# Altium project LEAF2GRID.PRJPCB
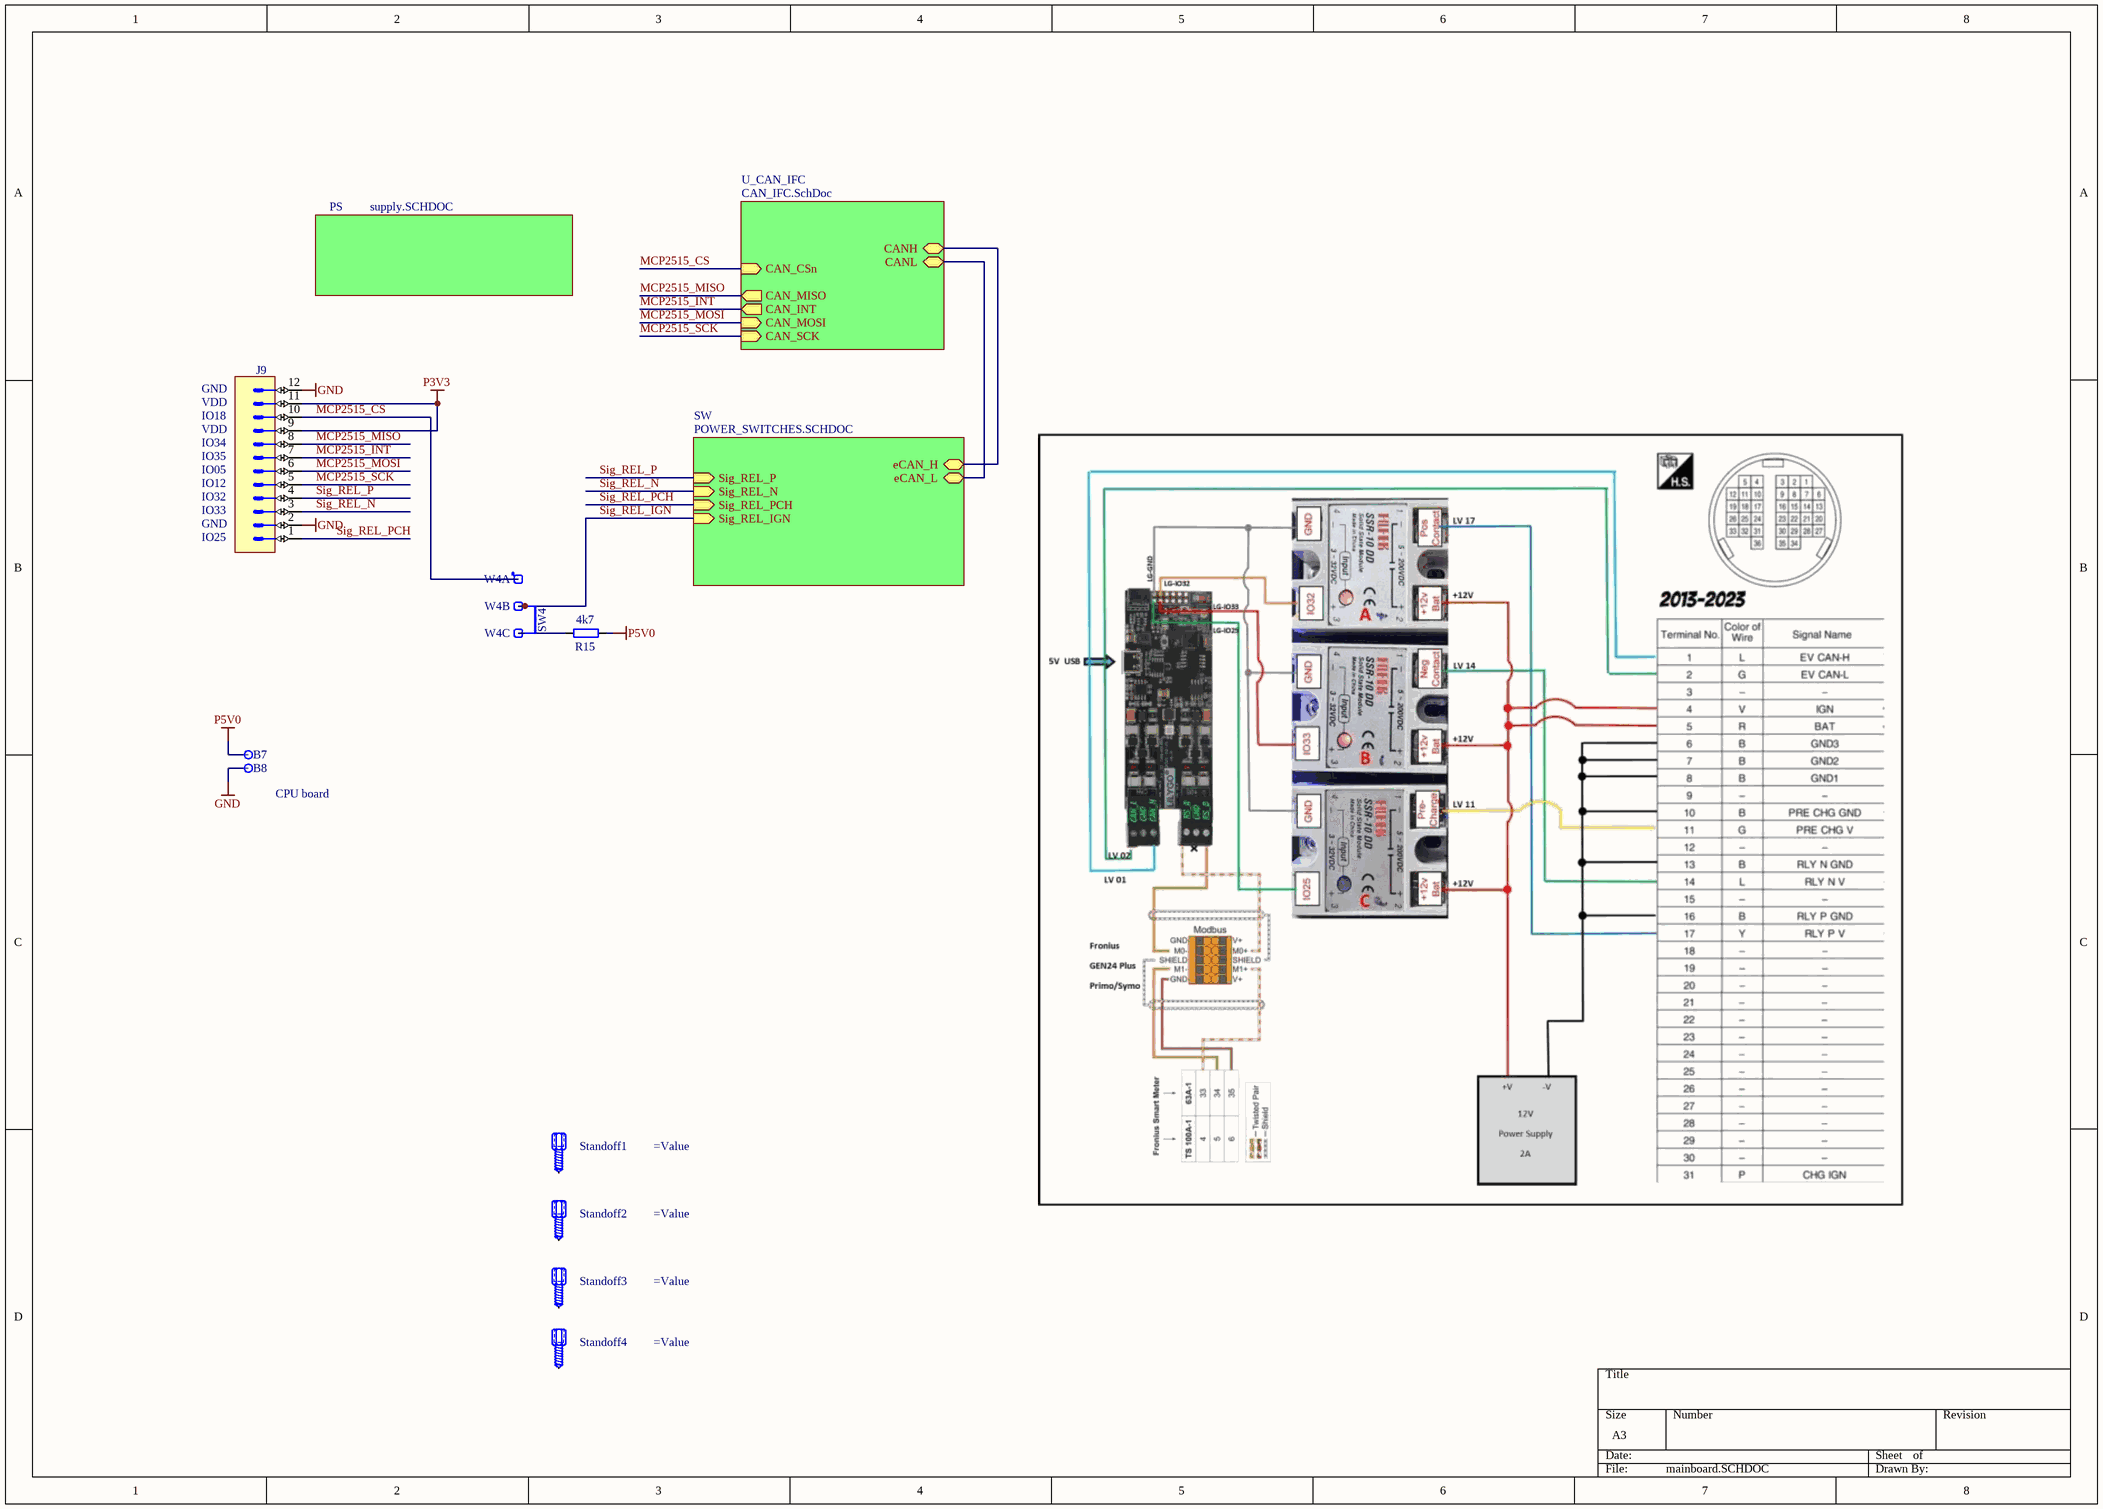
[diagram p0: mainboard.SCHDOC]
4 sheets, 117 parts. Net scope: hierarchical (ports join the sheet entries above them; power ports are global).
Board file: LEAF2GRID.PCBDOC
Sheets:
  mainboard.SCHDOC
    SW = POWER_SWITCHES.SCHDOC
    PS = supply.SCHDOC
    U_CAN_IFC = CAN_IFC.SchDoc

## Sheet mainboard.SCHDOC
size A3

### Parts
B7  Plated Hole  [c150h80]  (value not drawn)  (no BOM)
B8  Plated Hole  [c150h80]  (value not drawn)  (no BOM)
J9  Header 12  [SAMTEC_TSW-106-23-L-D]  (value not drawn)
R15  4k7  [RESC1608X55N]
Standoff1  (no value)  [ETTINGER_005.13.113]
Standoff2  (no value)  [ETTINGER_005.13.113]
Standoff3  (no value)  [ETTINGER_005.13.113]
Standoff4  (no value)  [ETTINGER_005.13.113]
SW4  Jumper Type1  [JUMPER_BLACK_INSULATED_2.54MM]  (value not drawn)
W4  Test Point  [COMATEL_385.0358.1.03.400]  (value not drawn)  (parts A,B,C of 3)

### Sub-sheets
PS = supply.SCHDOC: no entries
SW = POWER_SWITCHES.SCHDOC: Sig_REL_P (in), Sig_REL_N (in), Sig_REL_PCH (in), Sig_REL_IGN (in), eCAN_H (bidir), eCAN_L (bidir)
U_CAN_IFC = CAN_IFC.SchDoc: CANH (bidir), CANL (bidir), CAN_CSn (in), CAN_MISO (out), CAN_SCK (in), CAN_INT (out), CAN_MOSI (in)

### Nets
GND: B8.1 J9.2 J9.12
P3V3: J9.9 J9.11
P5V0: B7.1 R15.2
eCAN_H: sheet SW/eCAN_H, sheet U_CAN_IFC/CANH
eCAN_L: sheet SW/eCAN_L, sheet U_CAN_IFC/CANL
MCP2515_CS: J9.10 W4.1 ; sheet U_CAN_IFC/CAN_CSn  [project net CAN_CSn]
MCP2515_INT: J9.7 ; sheet U_CAN_IFC/CAN_INT  [project net CAN_INT]
MCP2515_MISO: J9.8 ; sheet U_CAN_IFC/CAN_MISO  [project net CAN_MISO]
MCP2515_MOSI : J9.6 ; sheet U_CAN_IFC/CAN_MOSI  [project net CAN_MOSI]
MCP2515_SCK: J9.5 ; sheet U_CAN_IFC/CAN_SCK  [project net CAN_SCK]
Sig_REL_IGN: SW4.1 W4.2 ; sheet SW/Sig_REL_IGN
Sig_REL_N: J9.3 ; sheet SW/Sig_REL_N
Sig_REL_P: J9.4 ; sheet SW/Sig_REL_P
Sig_REL_PCH: J9.1 ; sheet SW/Sig_REL_PCH
NetR15_1: R15.1 W4.3

Not connected (* = marked no-connect by the designer): Standoff1 1; Standoff2 1; Standoff3 1; Standoff4 1

### Notes on the sheet
- (near J9) IO34
- VDD
- (near J9) IO18
- GND
- (near J9) IO32
- (near J9) IO33
- (near J9) IO12
- (near J9) IO05
- (near J9) IO35
- (near J9) IO25
- CPU board

### Library data of the parts
B7 B8 = PLATED_HOLE0.8_PAD1.5: Single Terminal Socket; Part Description: Plated Through Hole: Hole Dia.=0.8mm Pad Dia.=1.5mm, IPC-7251 Level A; Mounted: No; Part Number: PLATED_HOLE0.8_PAD1.5; Component Type: Standard (No BOM); Pin Count: 1; Family: Plated Hole; Socket: No; SMD: No; Sense: No; Status: None; ComponentHeight: 0mm; HelpURL: Undefined; Author: CERN DEM JLC; CreateDate: 11.05.2017; LatestRevisionDate: 11.05.2017; PackageDescription: Plated Through Hole: Hole Dia.=0.8mm Pad Dia.=1.3mm, IPC-7251 Level A
J9 = SAMTEC_TSW-106-23-L-D: Connector 12 Male; Part Description: 12 Contacts, Pitch 2.54mm, Dual Row Through Mount Straight Header (Post Lead 5.84mm, Tail Lead 2.92mm, Insulator 2.54mm); Manufacturer: SAMTEC; PressFit: No; Part Number: SAMTEC_TSW-106-23-L-D; Component Kind: Standard; Component Type: Standard; Pin Count: 12; Family: Header 12; Mounted: Yes; Socket: No; SMD: No; Sense: No; Status: None; Manufacturer Part Number: TSW-106-23-L-D; ComponentHeight: 8.38mm; HelpURL: \\cern.ch\dfs\Applications\Altium\Datasheets\SAMTEC_TSW-106-23-L-D.pdf; Author: CERN DEM MR; CreateDate: 08.03.2017; LatestRevisionDate: 08.03.2017
R15 = R0603_4K7_1%_0.1W_100PPM: Resistor - 1%; Part Description: General Purpose Thick Film Chip Resistor; Manufacturer: GENERIC; Manufacturer1 Part Number: NRC06F4701TRF; Power: 0.1W; TC: ±100ppm/°C; PressFit: No; Part Number: R0603_4K7_1%_0.1W_100PPM; Component Kind: Standard; Component Type: Standard; Pin Count: 2; Value: 4k7; Status: Preferred; Tolerance: ±1%; Manufacturer Part Number: R0603_4K7_1%_0.1W_100PPM; Case: 0603; Mounted: Yes; Sense: No; Socket: No; SMD: Yes; Manufacturer1 Example: NIC COMPONENT; Manufacturer1 ComponentHeight: 0.55mm; HelpURL: \\cern.ch\dfs\Applications\Altium\Datasheets\R0603_NIC_NRC.pdf; Author: CERN DEM JLC; CreateDate: 03.12.2007; LatestRevisionDate: 13.03.2008
Standoff1-Standoff4 = ETTINGER_005.13.113: Standoff Male-Female; Part Description: Standoff Nickel-Plated Brass M/F AF5.5x11 F=M3x7 M=M3x6; PressFit: No; Part Number: ETTINGER_005.13.113; Component Kind: Standard; Component Type: Mechanical; Pin Count: 1; PackageDescription: Standoff Nickel-Plated Brass M/F AF5.5x11 F=M3x7 M=M3x6; Mounted: Yes; Socket: No; SMD: No; Sense: No; Status: None; Manufacturer: ETTINGER; Manufacturer Part Number: 005.13.113; ComponentHeight: 11mm; HelpURL: \\cern.ch\dfs\Applications\Altium\Datasheets\ETTINGER_005.13.113.pdf; Author: CERN DEM HF; CreateDate: 17.05.2023; LatestRevisionDate: 17.05.2023
SW4 = COMATEL_313.1730.0.00.40.0: Jumper 1 Pin; Part Description: Closed Insulated Black Jumper Pitch 2.54mm; Manufacturer: KONTEK COMATEL; PressFit: No; SCEM: 09.55.10.960.9; Part Number: COMATEL_313.1730.0.00.40.0; Component Kind: Accessories; Component Type: Standard; Pin Count: 1; Family: Jumper; Mounted: Yes; Socket: No; SMD: No; Sense: No; Status: Obsolete; Manufacturer Part Number: 313.1730.0.00.40.0; ComponentHeight: 6.5mm; HelpURL: \\cern.ch\dfs\Applications\Altium\Datasheets\COMATEL_313.1730.0.00.40.0.pdf; Author: CERN DEM JLC; CreateDate: 09.04.2008; LatestRevisionDate: 27.08.2013
W4 = COMATEL_385.0358.1.03.400: 3 Mini Wire-Wrap Contact Strip Header; Part Description: 3 Contacts Straight Strip Header Pitch 2.54mm L=6.3mm ''Mini-Wire-Wrap''; Manufacturer: KONTEK COMATEL; PressFit: No; Part Number: COMATEL_385.0358.1.03.400; Component Kind: Standard; Component Type: Standard; Pin Count: 3; Family: Test Point; Mounted: Yes; Socket: No; SMD: No; Sense: No; Status: Not recommended; Manufacturer Part Number: 385.0358.1.03.400; ComponentHeight: 8mm; HelpURL: \\cern.ch\dfs\Applications\Altium\Datasheets\COMATEL_385.0358.1.03.400.pdf; Author: CERN DEM JLC; CreateDate: 30.06.2010; LatestRevisionDate: 10.10.2012

## Sheet POWER_SWITCHES.SCHDOC
size A3
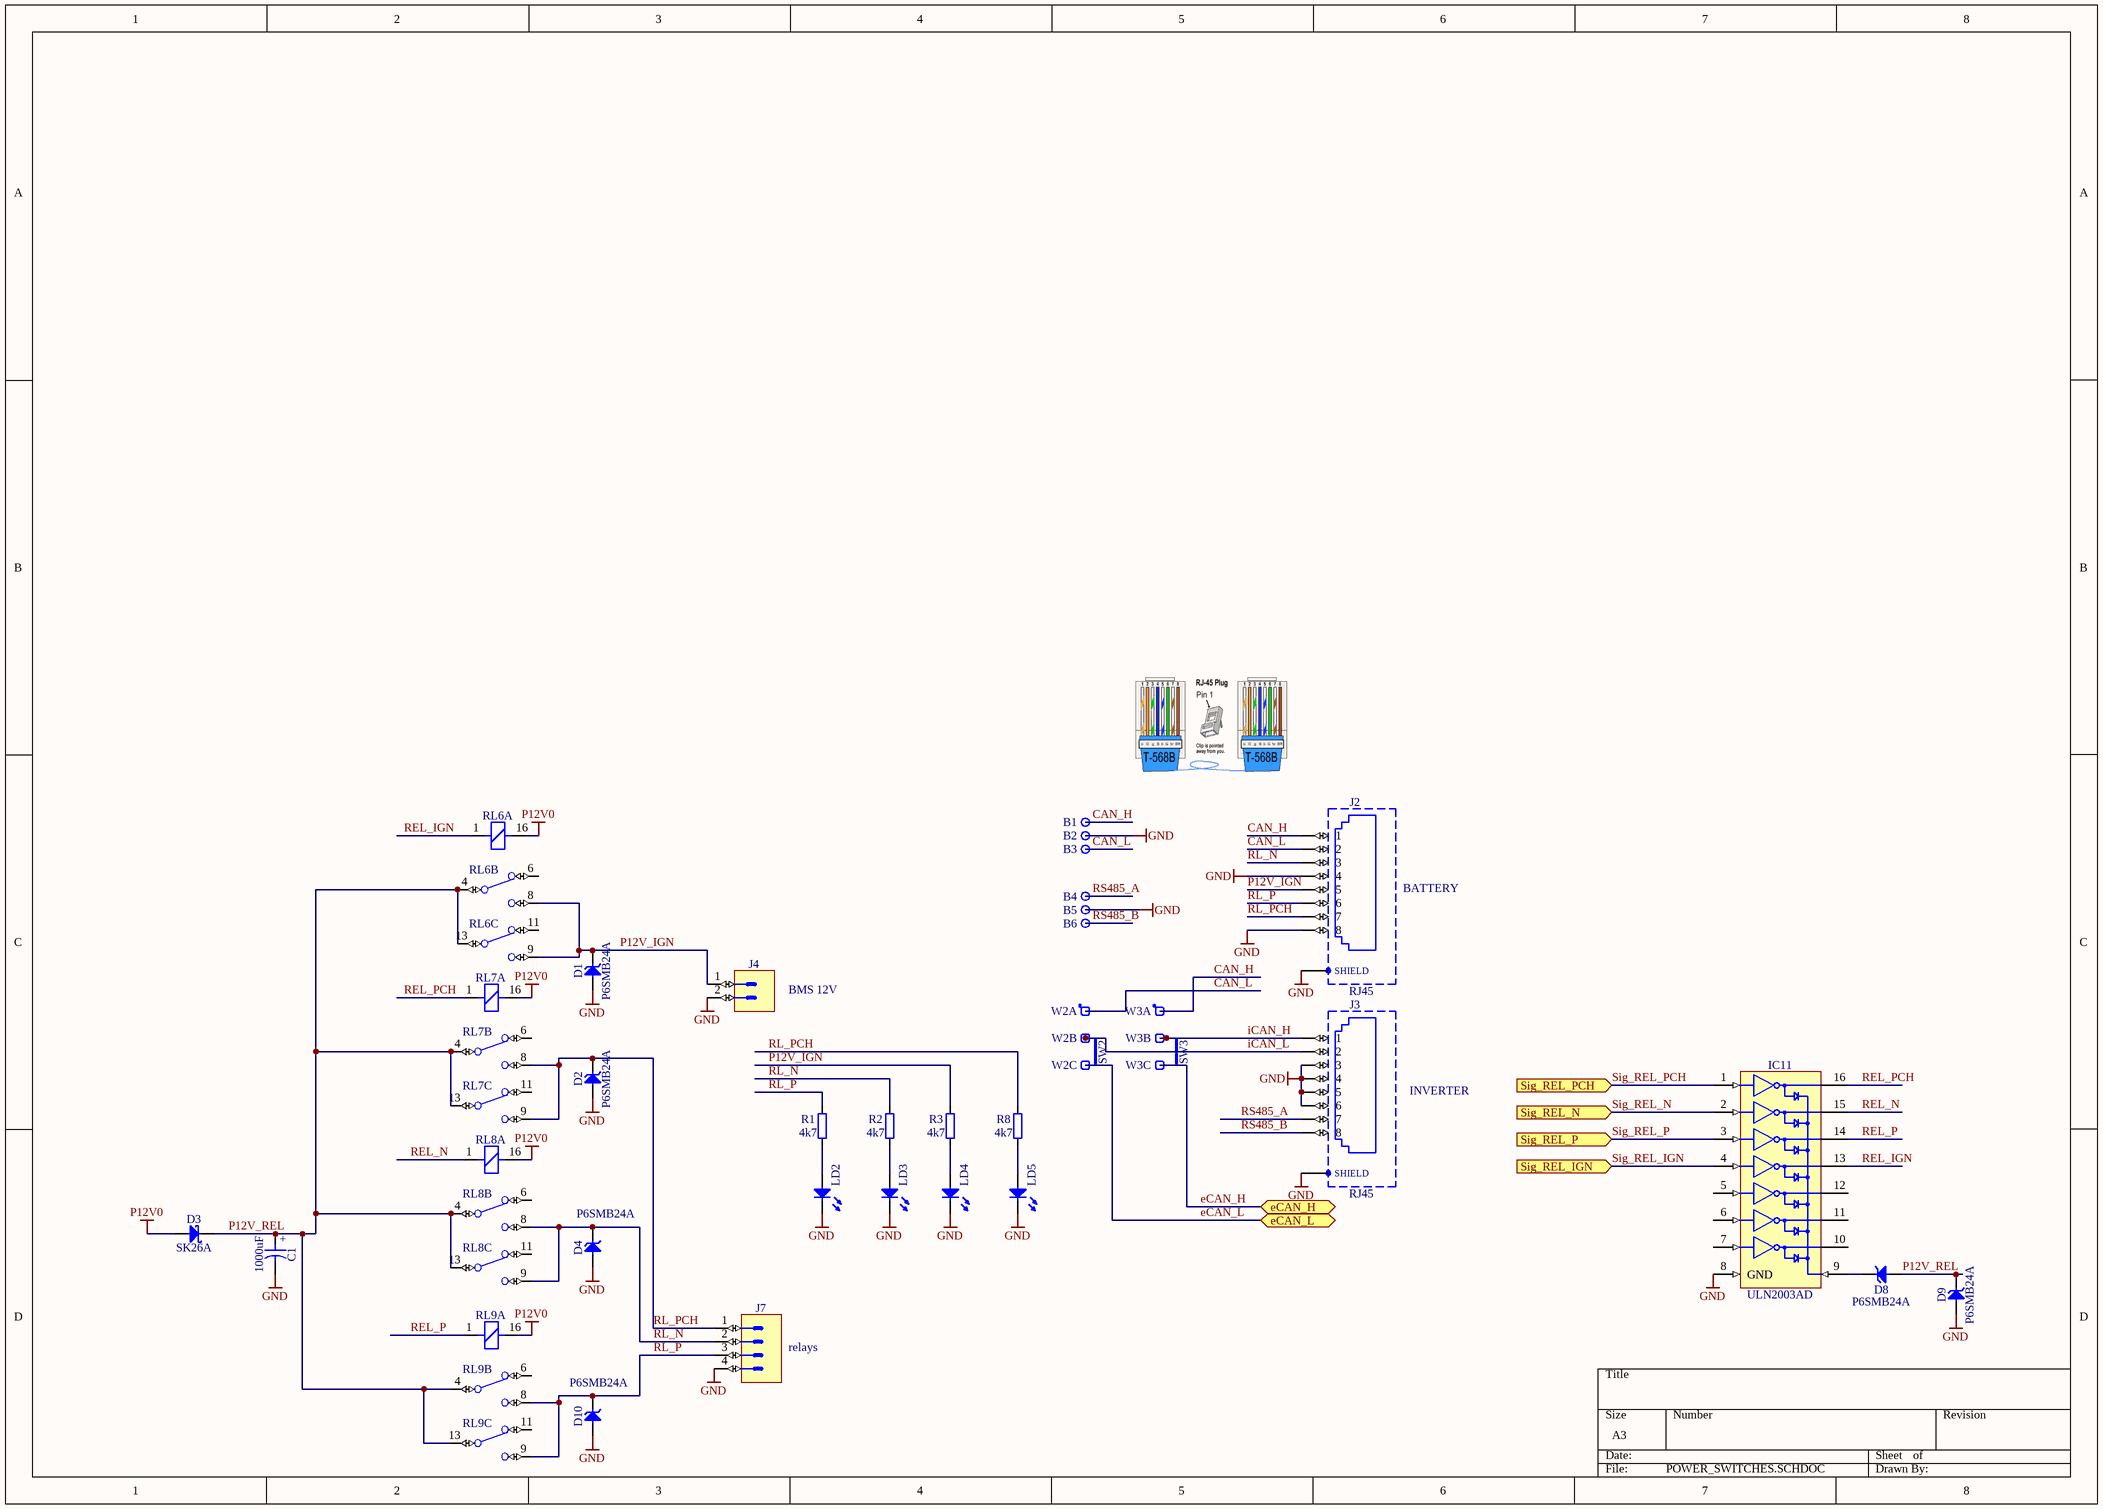
[diagram p1: POWER_SWITCHES.SCHDOC]

### Parts
B1  Plated Hole  [c150h80]  (value not drawn)  (no BOM)
B2  Plated Hole  [c150h80]  (value not drawn)  (no BOM)
B3  Plated Hole  [c150h80]  (value not drawn)  (no BOM)
B4  Plated Hole  [c150h80]  (value not drawn)  (no BOM)
B5  Plated Hole  [c150h80]  (value not drawn)  (no BOM)
B6  Plated Hole  [c150h80]  (value not drawn)  (no BOM)
C1  1000uF  [CAPPR500-1050X2200]
D1  P6SMB24A  [DIOM5436X261N]
D2  P6SMB24A  [DIOM5436X261N]
D3  SK26A  [DIOM5126X265N]
D4  P6SMB24A  [DIOM5436X261N]
D8  P6SMB24A  [DIOM5436X261N]
D9  P6SMB24A  [DIOM5436X261N]
D10  P6SMB24A  [DIOM5436X261N]
IC11  ULN2003AD  [SOIC127P600X175-16N]
J2  RJ45  [HIROSE_TM21R-5C-88]
J3  RJ45  [HIROSE_TM21R-5C-88]
J4  (no value)  [PHOENIX_1803277]
J7  (no value)  [PHOENIX_1803293]
LD2  Green  [LED_KINGBRIGHT_KP-1608CGCK]  (value not drawn)
LD3  Green  [LED_KINGBRIGHT_KP-1608CGCK]  (value not drawn)
LD4  Green  [LED_KINGBRIGHT_KP-1608CGCK]  (value not drawn)
LD5  Green  [LED_KINGBRIGHT_KP-1608CGCK]  (value not drawn)
R1  4k7  [RESC1608X55N]
R2  4k7  [RESC1608X55N]
R3  4k7  [RESC1608X55N]
R8  4k7  [RESC1608X55N]
RL6  REL_TYCO-AXICOM_MT2  [REL_TYCO-AXICOM_MT2]  (value not drawn)  (parts A,B,C of 3)
RL7  REL_TYCO-AXICOM_MT2  [REL_TYCO-AXICOM_MT2]  (value not drawn)  (parts A,B,C of 3)
RL8  REL_TYCO-AXICOM_MT2  [REL_TYCO-AXICOM_MT2]  (value not drawn)  (parts A,B,C of 3)
RL9  REL_TYCO-AXICOM_MT2  [REL_TYCO-AXICOM_MT2]  (value not drawn)  (parts A,B,C of 3)
SW2  Jumper Type1  [JUMPER_BLACK_INSULATED_2.54MM]  (value not drawn)
SW3  Jumper Type1  [JUMPER_BLACK_INSULATED_2.54MM]  (value not drawn)
W2  Test Point  [COMATEL_385.0358.1.03.400]  (value not drawn)  (parts A,B,C of 3)
W3  Test Point  [COMATEL_385.0358.1.03.400]  (value not drawn)  (parts A,B,C of 3)

### Ports
eCAN_H (bidir), eCAN_L (bidir), Sig_REL_IGN (in), Sig_REL_N (in), Sig_REL_P (in), Sig_REL_PCH (in)

### Nets
GND: B2.1 B5.1 C1.2 D1.2(A) D2.2(A) D4.2(A) D9.2(A) D10.2(A) IC11.8(GND) J2.4 J2.8 J2.SHIELD J3.3 J3.4 J3.5 J3.6 J3.SHIELD J4.2 J7.4 LD2.1(C) LD3.1(C) LD4.1(C) LD5.1(C)
P12V0: D3.2(A) RL6.16 RL7.16 RL8.16 RL9.16
CAN_H: B1.1 J2.1 W3.1
CAN_L: B3.1 J2.2 W2.1
eCAN_H: W3.3 ; port eCAN_H
eCAN_L: W2.3 ; port eCAN_L
iCAN_H: J3.1 SW3.1 W3.2
iCAN_L: J3.2 SW2.1 W2.2
P12V_IGN: D1.1(C) J2.5 J4.1 R3.2 RL6.8(NO) RL6.9(NO)
P12V_REL: C1.1 D3.1(C) D8.2(A) D9.1(C) RL6.4(C) RL6.13(C) RL7.4(C) RL7.13(C) RL8.4(C) RL8.13(C) RL9.4(C) RL9.13(C)
REL_IGN: IC11.13(OUT4) RL6.1
REL_N: IC11.15(OUT2) RL8.1
REL_P: IC11.14(OUT3) RL9.1
REL_PCH: IC11.16(OUT1) RL7.1
RL_N: D4.1(C) J2.3 J7.2 R2.2 RL8.8(NO) RL8.9(NO)
RL_P: D10.1(C) J2.6 J7.3 R1.2 RL9.8(NO) RL9.9(NO)
RL_PCH: D2.1(C) J2.7 J7.1 R8.2 RL7.8(NO) RL7.9(NO)
RS485_A: B4.1 J3.7
RS485_B: B6.1 J3.8
Sig_REL_IGN: IC11.4(IN4) ; port Sig_REL_IGN
Sig_REL_N: IC11.2(IN2) ; port Sig_REL_N
Sig_REL_P: IC11.3(IN3) ; port Sig_REL_P
Sig_REL_PCH: IC11.1(IN1) ; port Sig_REL_PCH
NetD8_1: D8.1(C) IC11.9(COM)
NetLD2_2: LD2.2(A) R1.1
NetLD3_2: LD3.2(A) R2.1
NetLD4_2: LD4.2(A) R3.1
NetLD5_2: LD5.2(A) R8.1

Not connected (* = marked no-connect by the designer): IC11 5(IN5) 6(IN6) 7(IN7) 10(OUT7) 11(OUT6) 12(OUT5); RL6 6(NC) 11(NC); RL7 6(NC) 11(NC); RL8 6(NC) 11(NC); RL9 6(NC) 11(NC)

### Notes on the sheet
- BATTERY
- BMS 12V
- INVERTER
- (near J7) relays
- (in symbol CAER_1000UF_25V_20%_VISHAY_MAL203856102E3) +

### Library data of the parts
B1-B6 = PLATED_HOLE0.8_PAD1.5: as B7 on sheet mainboard; Part Number: PLATED_HOLE0.8_PAD1.5; Component Type: Standard (No BOM); Pin Count: 1; Family: Plated Hole; Socket: No; SMD: No; Sense: No; Status: None; ComponentHeight: 0mm; HelpURL: Undefined; Author: CERN DEM JLC; CreateDate: 11.05.2017; LatestRevisionDate: 11.05.2017; PackageDescription: Plated Through Hole: Hole Dia.=0.8mm Pad Dia.=1.3mm, IPC-7251 Level A
C1 = CAER_1000UF_25V_20%_VISHAY_MAL203856102E3: Polarised capacitor; Part Description: Radial Standard Ultra Miniature Aluminum Electrolytic Capacitor (038 RSU Series); Manufacturer: VISHAY BCCOMPONENTS; Voltage: 25V; Tolerance: ±20%; Part Number: CAER_1000UF_25V_20%_VISHAY_MAL203856102E3; Component Kind: Standard; Component Type: Standard; Pin Count: 2; Value: 1000uF; Status: None; Manufacturer Part Number: MAL203856102E3; Case: LS5 D10.5 x H22; Mounted: Yes; Socket: No; SMD: No; Sense: No; ComponentHeight: 22mm; HelpURL: \\cern.ch\dfs\Applications\Altium\Datasheets\CAER_VISHAY_038 RSU.pdf; Author: CERN DEM JLC; CreateDate: 2012-08-27; LatestRevisionDate: 2012-08-27
D1 D2 D4 D8-D10 = P6SMB24A: Transient Voltage Suppressor Diode (Uni-Directional); Part Description: Uni-directional Transient Voltage Suppressor (TVS) Diode; Manufacturer: LITTELFUSE; Voltage: 24V; Power: 600W; PressFit: No; Bonding: No; Part Number: P6SMB24A; Component Kind: Standard; Component Type: Standard; Device: P6SMB24A; PackageDescription: DO-214-AA/SMB Diode, Molded Body; 5.40mm L X 3.62mm W X 2.61mm H, IPC Medium Density; Manufacturer Part Number: P6SMB24A; Pin Count: 2; Case: SMB; Mounted: Yes; Socket: No; SMD: Yes; Sense: No; ComponentHeight: 2.61mm; HelpURL: \\cern.ch\dfs\Applications\Altium\Datasheets\P6SMB24A.pdf; Author: CERN DEM JLC; CreateDate: 12.07.2017; LatestRevisionDate: 12.07.2017
D3 = SK26A: Schottky Diode; Part Description: 2A, 60V Surface Mount Schottky Barrier Rectifier; Manufacturer: TAIWAN SEMICONDUCTOR; Voltage: 60V; Power: 2A; PressFit: No; Bonding: No; Part Number: SK26A; Component Kind: Standard; Component Type: Standard; Device: SK26A; PackageDescription: DO-214-AC/SMA Molded Diode, 2-Leads, Body 5.1x2.6mm, IPC Medium Density; Manufacturer Part Number: SK26A; Pin Count: 2; Case: DO-214AC; Mounted: Yes; Socket: No; SMD: Yes; Sense: No; ComponentHeight: 2.5mm; HelpURL: \\cern.ch\dfs\Applications\Altium\Datasheets\SK26A.pdf; Author: CERN DEM JMW; CreateDate: 2015-08-07; LatestRevisionDate: 2015-08-07
IC11 = ULN2003AD: Seven darlington array; Part Description: High-Voltage High-Current Darlington Array; Manufacturer: TEXAS INSTRUMENTS; PressFit: No; Bonding: No; Part Number: ULN2003AD; Component Kind: Standard; Component Type: Standard; Device: ULN2003AD; PackageDescription: SOIC 16, Pitch 1.27mm - Body 4x10mm, IPC Medium Density; Manufacturer Part Number: ULN2003AD; Pin Count: 16; Case: SOIC16; Mounted: Yes; Socket: No; SMD: Yes; Sense: No; ComponentHeight: 1.75mm; Author: CERN DEM JLC; HelpURL: \\cern.ch\dfs\Applications\Altium\Datasheets\ULN2003AD.pdf; CreateDate: 2009-08-04; LatestRevisionDate: 2009-08-04
J2 J3 = HIROSE_TM21R-5C-88(50): Connector RJ45 + Shield; Part Description: 1 Port, Tab-Down, Horizontal Shielded 8P8C RJ45 Modular Jack Connectors for High-speed LAN Transmission; Manufacturer: HIROSE (HRS); PressFit: No; Part Number: HIROSE_TM21R-5C-88(50); Component Kind: Standard; Component Type: Standard; Pin Count: 10; Family: RJ45; Mounted: Yes; Socket: No; SMD: No; Sense: No; Status: None; Manufacturer Part Number: TM21R-5C-88(50); ComponentHeight: 13.75mm; HelpURL: \\cern.ch\dfs\Applications\Altium\Datasheets\HIROSE_TM21R-5C-88.pdf; Author: CERN DEM BC; CreateDate: 08.09.2020; LatestRevisionDate: 08.09.2020
J4 = PHOENIX_1803277: Connector 2 Male; Part Description: 8A 160 V, Pitch: 3.81mm, 2 Positions  Right Angled Header; Manufacturer: PHOENIX CONTACT; Manufacturer Part Number: 1803277 (MC 1,5/ 2-G-3,81); PressFit: No; Part Number: PHOENIX_1803277; Component Kind: Standard; Component Type: Standard; Pin Count: 2; Mounted: Yes; Socket: No; SMD: No; Sense: No; Status: None; ComponentHeight: 7.25mm; HelpURL: \\cern.ch\dfs\Applications\Altium\Datasheets\PHOENIX_1803277.pdf; Author: CERN DEM JLC; CreateDate: 06.05.2014; LatestRevisionDate: 06.05.2014
J7 = PHOENIX_1803293: Connector 4 Male; Part Description: 8A 160 V, Pitch: 3.81mm, 4 Positions  Right Angled Header; Manufacturer: PHOENIX CONTACT; Manufacturer Part Number: 1803293 (MC 1,5/ 4-G-3,81); PressFit: No; Part Number: PHOENIX_1803293; Component Kind: Standard; Component Type: Standard; Pin Count: 4; Mounted: Yes; Socket: No; SMD: No; Sense: No; Status: None; ComponentHeight: 7.25mm; HelpURL: \\cern.ch\dfs\Applications\Altium\Datasheets\PHOENIX_1803293.pdf; Author: CERN DEM JLC; CreateDate: 06.05.2014; LatestRevisionDate: 06.05.2014
LD2-LD5 = LED_KINGBRIGHT_KP-1608CGCK: LED Green 1C 2A; Part Description: 1.6x0.8mm SMD Chip Green LED Lamp; PressFit: No; Bonding: No; Part Number: LED_KINGBRIGHT_KP-1608CGCK; Component Kind: Standard; Component Type: Standard; Color: Green; PackageDescription: SMT Green LED, Case 0603, Body L 1.60mm x W 0.80mm x H 1.10mm; Manufacturer: KINGBRIGHT; Manufacturer Part Number: KP-1608CGCK; Pin Count: 2; Case: 0603; Mounted: Yes; Socket: No; SMD: Yes; Sense: No; ComponentHeight: 1.1mm; HelpURL: \\cern.ch\dfs\Applications\Altium\Datasheets\LED_KINGBRIGHT_KP-1608CGCK.pdf; Author: CERN DEM HF; CreateDate: 01.10.2021; LatestRevisionDate: 01.10.2021
R1-R3 R8 = R0603_4K7_1%_0.1W_100PPM: as R15 on sheet mainboard; Part Number: R0603_4K7_1%_0.1W_100PPM; Component Kind: Standard; Component Type: Standard; Pin Count: 2; Value: 4k7; Status: Preferred; Tolerance: ±1%; Manufacturer Part Number: R0603_4K7_1%_0.1W_100PPM; Case: 0603; Mounted: Yes; Sense: No; Socket: No; SMD: Yes; Manufacturer1 Example: NIC COMPONENT; Manufacturer1 ComponentHeight: 0.55mm; HelpURL: \\cern.ch\dfs\Applications\Altium\Datasheets\R0603_NIC_NRC.pdf; Author: CERN DEM JLC; CreateDate: 03.12.2007; LatestRevisionDate: 13.03.2008
RL6-RL9 = REL_TYCO-AXICOM_C93402: DPDT Signal and RF Relay, MT2 Serie; Part Description: DPDT Communications/Signal Relay (150mW High Sensitive Coil), MT2 Series; Manufacturer: TYCO AXICOM; Manufacturer Part Number: C93402 or 1462000-7; PressFit: No; Value: 12VDC; Sense Comment: Cleaning Limitation; Status Comment: Sensitive (See Sensitive Field); Part Number: REL_TYCO-AXICOM_C93402; Component Kind: Standard; Component Type: Standard; Pin Count: 8; PackageDescription: 8 Leads, Row Spacing 7.62mm; Body 20.25mm x 10.05mm, AXICOM MT2 Series; Mounted: Yes; Socket: No; SMD: No; Sense: Yes; Status: Not Recommended; ComponentHeight: 11.2mm; HelpURL: \\cern.ch\dfs\Applications\Altium\Datasheets\REL_TYCO-AXICOM_MT2.pdf; Author: CERN DEM JLC; CreateDate: 24.05.2012; LatestRevisionDate: 04.09.2018
SW2 SW3 = COMATEL_313.1730.0.00.40.0: as SW4 on sheet mainboard; Part Number: COMATEL_313.1730.0.00.40.0; Component Kind: Accessories; Component Type: Standard; Pin Count: 1; Family: Jumper; Mounted: Yes; Socket: No; SMD: No; Sense: No; Status: Obsolete; Manufacturer Part Number: 313.1730.0.00.40.0; ComponentHeight: 6.5mm; HelpURL: \\cern.ch\dfs\Applications\Altium\Datasheets\COMATEL_313.1730.0.00.40.0.pdf; Author: CERN DEM JLC; CreateDate: 09.04.2008; LatestRevisionDate: 27.08.2013
W2 W3 = COMATEL_385.0358.1.03.400: as W4 on sheet mainboard; Part Number: COMATEL_385.0358.1.03.400; Component Kind: Standard; Component Type: Standard; Pin Count: 3; Family: Test Point; Mounted: Yes; Socket: No; SMD: No; Sense: No; Status: Not recommended; Manufacturer Part Number: 385.0358.1.03.400; ComponentHeight: 8mm; HelpURL: \\cern.ch\dfs\Applications\Altium\Datasheets\COMATEL_385.0358.1.03.400.pdf; Author: CERN DEM JLC; CreateDate: 30.06.2010; LatestRevisionDate: 10.10.2012

## Sheet supply.SCHDOC
size A4
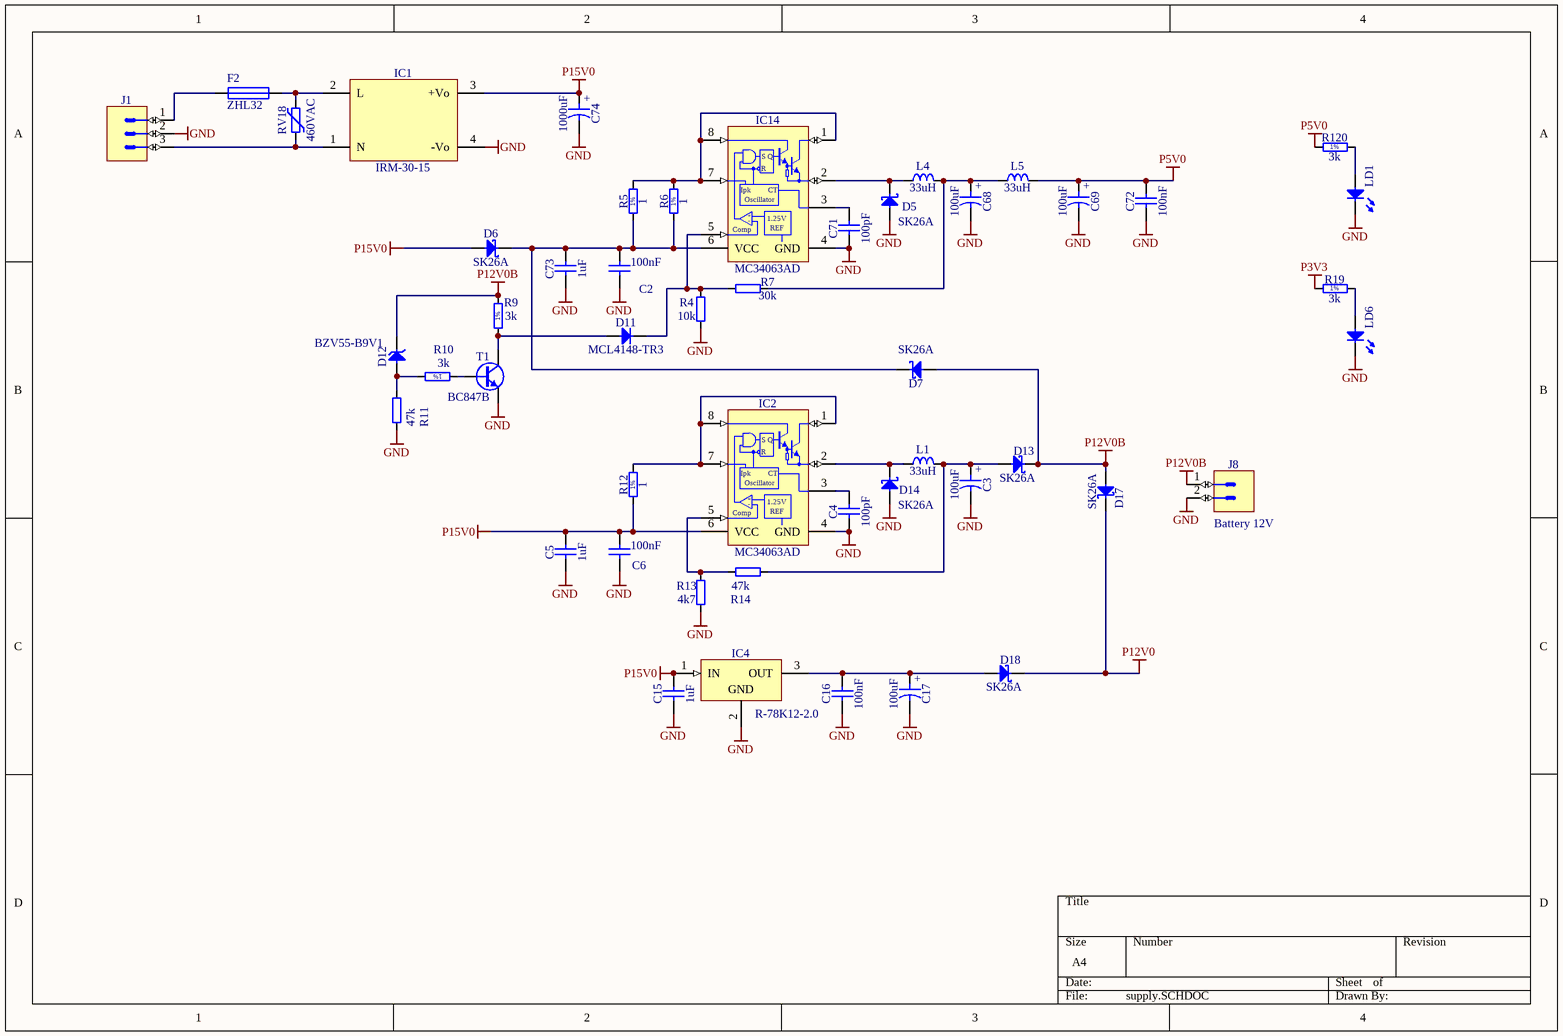
[diagram p2: supply.SCHDOC]

### Parts
C2  100nF  [CAPC1608X87N]
C3  100uF  [CAPAE660X540N]
C4  100pF  [CAPC1608X87N]
C5  1uF  [CAPC1608X87N]
C6  100nF  [CAPC1608X87N]
C15  1uF  [CAPC1608X87N]
C16  100nF  [CAPC1608X87N]
C17  100uF  [CAPAE660X540N]
C68  100uF  [CAPAE660X540N]
C69  100uF  [CAPAE660X540N]
C71  100pF  [CAPC1608X87N]
C72  100nF  [CAPC1608X87N]
C73  1uF  [CAPC1608X87N]
C74  1000uF  [CAPPR500-1050X2200]
D5  SK26A  [DIOM5126X265N]
D6  SK26A  [DIOM5126X265N]
D7  SK26A  [DIOM5126X265N]
D11  MCL4148-TR3  [DIOMELF1911N]
D12  BZV55-B9V1  [DIOMELF3515N]
D13  SK26A  [DIOM5126X265N]
D14  SK26A  [DIOM5126X265N]
D17  SK26A  [DIOM5126X265N]
D18  SK26A  [DIOM5126X265N]
F2  ZHL32  [fuse_ZHL32]
IC1  IRM-30-15  [PWS_MEANWELL_IRM-30]
IC2  MC34063AD  [SOIC127P600X175-8N]
IC4  R-78K12-2.0  [DCDC_RECOM_R-78C]
IC14  MC34063AD  [SOIC127P600X175-8N]
J1  (no value)  [PHOENIX_1757255]
J8  (no value)  [PHOENIX_1803277]
L1  33uH  [IND_BOURNS_SRP1038A]
L4  33uH  [IND_BOURNS_SRP1038A]
L5  33uH  [IND_BOURNS_SRP1038A]
LD1  Green  [LED_KINGBRIGHT_KP-1608CGCK]  (value not drawn)
LD6  Green  [LED_KINGBRIGHT_KP-1608CGCK]  (value not drawn)
R4  10k  [RESC1608X55N]
R5  1  [RESC1608X55N]
R6  1  [RESC1608X55N]
R7  30k  [RESC1608X55N]
R9  3k  [RESC1608X55N]
R10  3k  [RESC1608X55N]
R11  47k  [RESC1608X55N]
R12  1  [RESC1608X55N]
R13  4k7  [RESC1608X55N]
R14  47k  [RESC1608X55N]
R19  3k  [RESC1608X55N]
R120  3k  [RESC1608X55N]
RV18  460VAC  [VAR_EPCOS_B72210S0461K101]
T1  BC847B  [SOT95P230X110-3N]

### Nets
GND: C2.1 C3.2 C4.1 C5.1 C6.1 C15.1 C16.1 C17.2 C68.2 C69.2 C71.1 C72.1 C73.1 C74.2 D5.2(A) D14.2(A) IC1.4(-Vo) IC2.4(GND) IC4.2(GND) IC14.4(GND) J1.2 J8.2 LD1.1(C) LD6.1(C) R4.1 R11.1 R13.1 T1.2(E)
P3V3: R19.1
P5V0: C69.1 C72.2 L5.2 R120.1
P12V0: D17.1(C) D18.1(C)
P12V0B: D7.2(A) D12.1(C) D13.1(C) D17.2(A) J8.1 R9.2
P15V0: C5.2 C6.2 C15.2 C74.1 D6.2(A) IC1.3(+Vo) IC2.6(VCC) IC4.1(IN) R12.1
NetC2_2: C2.2 C73.2 D6.1(C) D7.1(C) IC14.6(VCC) R5.1 R6.1
NetC3_1: C3.1 D13.2(A) L1.2 R14.2
NetC4_2: C4.2 IC2.3(TC)
NetC16_2: C16.2 C17.1 D18.2(A) IC4.3(OUT)
NetC68_1: C68.1 L4.2 L5.1 R7.2
NetC71_2: C71.2 IC14.3(TC)
NetD5_1: D5.1(C) IC14.2(SWE) L4.1
NetD11_1: D11.1(C) IC14.5(COMP) R4.2 R7.1
NetD11_2: D11.2(A) R9.1 T1.3(C)
NetD12_2: D12.2(A) R10.2 R11.2
NetD14_1: D14.1(C) IC2.2(SWE) L1.1
NetF2_1: F2.1 J1.1
NetF2_2: F2.2 IC1.2(L) RV18.2
NetIC1_1: IC1.1(N) J1.3 RV18.1
NetIC2_1: IC2.1(SWC) IC2.7(Ipk) IC2.8(DRVC) R12.2
NetIC2_5: IC2.5(COMP) R13.2 R14.1
NetIC14_1: IC14.1(SWC) IC14.7(Ipk) IC14.8(DRVC) R5.2 R6.2
NetLD1_2: LD1.2(A) R120.2
NetLD6_2: LD6.2(A) R19.2
NetR10_1: R10.1 T1.1(B)

### Notes on the sheet
- (near J8) Battery 12V
- (in symbol CAE660-540_100UF_16V_20%) +
- (in symbol CAER_1000UF_25V_20%_VISHAY_MAL203856102E3) +
- (in symbol MC34063AD) S; Q; R; CT; Oscillator; +; -; 1.25V; Comp; REF
- (in symbol R0603_1R_1%_0.1W_200PPM) 1%
- (in symbol R0603_3K_1%_0.1W_100PPM) 1%

### Library data of the parts
C2 C6 C16 C72 = CC0603_100NF_50V_10%_X7R: Non-polarised capacitor; Part Description: SMD Multilayer Chip Ceramic Capacitor; Manufacturer: GENERIC; Manufacturer1 Part Number: 223858615649; Voltage: 50V; TC: X7R; Tolerance: ±10%; Part Number: CC0603_100NF_50V_10%_X7R; Component Kind: Standard; Component Type: Standard; Pin Count: 2; Value: 100nF; Status: Preferred; Manufacturer Part Number: CC0603_100NF_50V_10%_X7R; Case: 0603; Mounted: Yes; Socket: No; SMD: Yes; Sense: No; Manufacturer1 Example: PHYCOMP; Manufacturer1 ComponentHeight: 0.87mm; HelpURL: \\cern.ch\dfs\Applications\Altium\Datasheets\CC0603_X7R_PHYCOMP.pdf; Author: CERN DEM JLC; CreateDate: 2007-12-03; LatestRevisionDate: 2007-12-03
C3 C17 C68 C69 = CAE660-540_100UF_16V_20%: Polarised capacitor; Part Description: Aluminum Electrolytic SMT Capacitor; Manufacturer: PANASONIC; Manufacturer Part Number: EEEFK1C101AP; Voltage: 16V; Tolerance: ±20%; Part Number: CAE660-540_100UF_16V_20%; Component Kind: Standard; Component Type: Standard; Pin Count: 2; Value: 100uF; Status: Not Recommended; Case: D; Mounted: Yes; Socket: No; SMD: Yes; Sense: No; ComponentHeight: 5.8mm; HelpURL: \\cern.ch\dfs\Applications\Altium\Datasheets\CAE_PANASONIC_FK.pdf; Author: CERN DEM JLC; CreateDate: 2007-12-03; LatestRevisionDate: 2014-11-05
C4 C71 = CC0603_100PF_50V_10%_X7R: Non-polarised capacitor; Part Description: SMD Multilayer Chip Ceramic Capacitor; Manufacturer: GENERIC; Manufacturer1 Part Number: 223858615609; Voltage: 50V; TC: X7R; Tolerance: ±10%; Part Number: CC0603_100PF_50V_10%_X7R; Component Kind: Standard; Component Type: Standard; Pin Count: 2; Value: 100pF; Status: Preferred; Manufacturer Part Number: CC0603_100PF_50V_10%_X7R; Case: 0603; Mounted: Yes; Socket: No; SMD: Yes; Sense: No; Manufacturer1 Example: PHYCOMP; Manufacturer1 ComponentHeight: 0.9mm; HelpURL: \\cern.ch\dfs\Applications\Altium\Datasheets\CC0603_X7R_PHYCOMP.pdf; Author: CERN DEM JLC; CreateDate: 2012-08-15; LatestRevisionDate: 2012-08-15
C5 C15 C73 = CC0603_1UF_25V_10%_X7R: Non-polarised capacitor; Part Description: SMD Multilayer Chip Ceramic Capacitor; Manufacturer: GENERIC; Manufacturer1 Part Number: GRM188R71E105KA12D; Voltage: 25V; TC: X7R; Tolerance: ±10%; Part Number: CC0603_1UF_25V_10%_X7R; Component Kind: Standard; Component Type: Standard; Pin Count: 2; Value: 1uF; Status: None; Manufacturer Part Number: CC0603_1UF_25V_10%_X7R; Case: 0603; Mounted: Yes; Socket: No; SMD: Yes; Sense: No; Manufacturer1 Example: MURATA; Manufacturer1 ComponentHeight: 0.9mm; HelpURL: \\cern.ch\dfs\Applications\Altium\Datasheets\CC0603_X7R_MURATA.pdf; Author: CERN DEM JLC; CreateDate: 2011-01-18; LatestRevisionDate: 2011-01-18
C74 = CAER_1000UF_25V_20%_VISHAY_MAL203856102E3: as C1 on sheet POWER_SWITCHES; Part Number: CAER_1000UF_25V_20%_VISHAY_MAL203856102E3; Component Kind: Standard; Component Type: Standard; Pin Count: 2; Value: 1000uF; Status: None; Manufacturer Part Number: MAL203856102E3; Case: LS5 D10.5 x H22; Mounted: Yes; Socket: No; SMD: No; Sense: No; ComponentHeight: 22mm; HelpURL: \\cern.ch\dfs\Applications\Altium\Datasheets\CAER_VISHAY_038 RSU.pdf; Author: CERN DEM JLC; CreateDate: 2012-08-27; LatestRevisionDate: 2012-08-27
D5-D7 D13 D14 D17 D18 = SK26A: as D3 on sheet POWER_SWITCHES; Part Number: SK26A; Component Kind: Standard; Component Type: Standard; Device: SK26A; PackageDescription: DO-214-AC/SMA Molded Diode, 2-Leads, Body 5.1x2.6mm, IPC Medium Density; Manufacturer Part Number: SK26A; Pin Count: 2; Case: DO-214AC; Mounted: Yes; Socket: No; SMD: Yes; Sense: No; ComponentHeight: 2.5mm; HelpURL: \\cern.ch\dfs\Applications\Altium\Datasheets\SK26A.pdf; Author: CERN DEM JMW; CreateDate: 2015-08-07; LatestRevisionDate: 2015-08-07
D11 = MCL4148-TR3: Diode; Part Description: Small Signal Fast Switching Diode; Manufacturer: VISHAY GENERAL SEMICONDUCTOR; Voltage: 75V; Power: 200mA; PressFit: No; Bonding: No; Part Number: MCL4148-TR3; Component Kind: Standard; Component Type: Standard; Device: MCL4148-TR3; PackageDescription: MELF Diode, 2-Leads, Body 1.7x1.15mm, IPC Medium Density; Manufacturer Part Number: MCL4148; Pin Count: 2; Mounted: Yes; Socket: No; SMD: Yes; Sense: No; ComponentHeight: 1.35mm; HelpURL: \\cern.ch\dfs\Applications\Altium\Datasheets\MCL4148-TR3.pdf; Author: CERN DEM JLC; CreateDate: 10.11.2014; LatestRevisionDate: 10.11.2014
D12 = BZV55-B9V1: Zener Diode; Part Description: Voltage Regulator Diode; Manufacturer: NEXPERIA; Voltage: 9V1; Power: 500mW; PressFit: No; Bonding: No; Part Number: BZV55-B9V1; Component Kind: Standard; Component Type: Standard; Device: BZV55-B9V1; PackageDescription: SOD80C, MELF Diode, 2-Leads, Body 3.5x1.5mm, IPC Medium Density; Manufacturer Part Number: BZV55-B9V1; Pin Count: 2; Case: SOD-80C; Mounted: Yes; Socket: No; SMD: Yes; Sense: No; ComponentHeight: 1.6mm; HelpURL: \\cern.ch\dfs\Applications\Altium\Datasheets\BZV55.pdf; Author: CERN DEM JLC; CreateDate: 06.05.2008; LatestRevisionDate: 22.01.2018
F2 = FUSE
IC1 = AC_DC_IRM-30-15: Power Supply; Part Description: 85-264VAC to 15VDC (2000mA) 30W Power Supply; Manufacturer: MEAN WELL; PressFit: No; Bonding: No; Part Number: IRM-30-15; Component Kind: Standard; Component Type: Standard; Device: IRM-30-15; PackageDescription: IRM-10 Series, Body 45.7x25.4mm, Power Supply; Status: None; Manufacturer Part Number: IRM-30-15; Pin Count: 4; Mounted: Yes; Socket: No; SMD: No; Sense: No; ComponentHeight: 21.5mm; HelpURL: \\cern.ch\dfs\Applications\Altium\Datasheets\IRM-10-12.pdf; Author: GK; CreateDate: 14.02.2018; LatestRevisionDate: 14.02.2018
IC2 IC14 = MC34063AD: 3V to 40V 1.5A Peak Boost/Buck/Inverting Switching Regulator; Manufacturer: TEXAS INSTRUMENTS; PressFit: No; Bonding: No; Part Number: MC34063AD; Component Kind: Standard; Component Type: Standard; Device: MC34063AD; PackageDescription: SOIC 8, Pitch 1.27mm - Body 4x5mm, IPC Medium Density; Part Description: 3V to 40V 1.5A Peak Boost/Buck/Inverting Switching Regulator; Manufacturer Part Number: MC34063AD; Pin Count: 8; Case: SOIC8; Mounted: Yes; Socket: No; SMD: Yes; Sense: No; ComponentHeight: 1.75mm; HelpURL: \\cern.ch\dfs\Applications\Altium\Datasheets\MC34063AD.pdf; Author: CERN DEM JLC; CreateDate: 2009-10-27; LatestRevisionDate: 2009-10-27
IC4 = R-78C12-1.0: 15-42VDC to 12VDC, Iout (max) 1A, DC-DC Converter; Part Description: DC/DC; Uin: 14÷36V; Uout: 12VDC; Iout: 2A; SIP3; THT; Manufacturer: RECOM; PressFit: No; Bonding: No; Part Number: R-78K12-2.0; Component Kind: Standard; Component Type: Standard; Device: R-78K12-2.0; PackageDescription: R-78C Series, Body 11.6x8.50mm, SIP-3 Package; Manufacturer Part Number: R-78K12-2.0; Pin Count: 3; Mounted: Yes; Socket: No; SMD: No; Sense: No; ComponentHeight: 10.9mm; HelpURL: \\cern.ch\dfs\Applications\Altium\Datasheets\RECOM_R-78C.pdf; Author: CERN DEM BC; CreateDate: 19.08.2020; LatestRevisionDate: 19.08.2020
J1 = PHOENIX_1757255: Connector 3 Male; Part Description: 12A, 250V, Pitch 5.08mm, 3 Positions Header; Manufacturer: PHOENIX CONTACT; Manufacturer Part Number: 1757255 (MSTBA 2,5/ 3-G-5,08); PressFit: No; Part Number: PHOENIX_1757255; Component Kind: Standard; Component Type: Standard; Pin Count: 3; Mounted: Yes; Socket: No; SMD: No; Sense: No; Status: None; ComponentHeight: 8.6mm; HelpURL: \\cern.ch\dfs\Applications\Altium\Datasheets\PHOENIX_1757255.pdf; Author: CERN DEM JLC; CreateDate: 10.02.2010; LatestRevisionDate: 26.04.2010
J8 = PHOENIX_1803277: as J4 on sheet POWER_SWITCHES; Part Number: PHOENIX_1803277; Component Kind: Standard; Component Type: Standard; Pin Count: 2; Mounted: Yes; Socket: No; SMD: No; Sense: No; Status: None; ComponentHeight: 7.25mm; HelpURL: \\cern.ch\dfs\Applications\Altium\Datasheets\PHOENIX_1803277.pdf; Author: CERN DEM JLC; CreateDate: 06.05.2014; LatestRevisionDate: 06.05.2014
L1 L4 L5 = IND_33UH_20%_BOURNS_SRP1038A: Inductor; Part Description: Shielded SMD Power Inductor; Manufacturer: BOURNS; Manufacturer Part Number: SRP1038A-330M; Power: 3.5A; Resistance: 0.092R; Tolerance: ±20%; Part Number: IND_33UH_20%_BOURNS_SRP1038A; Component Kind: Standard; Component Type: Standard; Pin Count: 2; Value: 33uH; Mounted: Yes; Socket: No; SMD: Yes; Sense: No; ComponentHeight: 4mm; HelpURL: \\cern.ch\dfs\Applications\Altium\Datasheets\IND_BOURNS_SRP1038A.pdf; Author: CERN DEM HF; CreateDate: 26.01.2024; LatestRevisionDate: 26.01.2024
LD1 LD6 = LED_KINGBRIGHT_KP-1608CGCK: as LD2 on sheet POWER_SWITCHES; Part Number: LED_KINGBRIGHT_KP-1608CGCK; Component Kind: Standard; Component Type: Standard; Color: Green; PackageDescription: SMT Green LED, Case 0603, Body L 1.60mm x W 0.80mm x H 1.10mm; Manufacturer: KINGBRIGHT; Manufacturer Part Number: KP-1608CGCK; Pin Count: 2; Case: 0603; Mounted: Yes; Socket: No; SMD: Yes; Sense: No; ComponentHeight: 1.1mm; HelpURL: \\cern.ch\dfs\Applications\Altium\Datasheets\LED_KINGBRIGHT_KP-1608CGCK.pdf; Author: CERN DEM HF; CreateDate: 01.10.2021; LatestRevisionDate: 01.10.2021
R4 = R0603_10K_1%_0.1W_100PPM: Resistor - 1%; Part Description: General Purpose Thick Film Chip Resistor; Manufacturer: GENERIC; Manufacturer1 Part Number: NRC06F1002TRF; Power: 0.1W; TC: ±100ppm/°C; PressFit: No; Part Number: R0603_10K_1%_0.1W_100PPM; Component Kind: Standard; Component Type: Standard; Pin Count: 2; Value: 10k; Status: Preferred; Tolerance: ±1%; Manufacturer Part Number: R0603_10K_1%_0.1W_100PPM; Case: 0603; Mounted: Yes; Sense: No; Socket: No; SMD: Yes; Manufacturer1 Example: NIC COMPONENT; Manufacturer1 ComponentHeight: 0.55mm; HelpURL: \\cern.ch\dfs\Applications\Altium\Datasheets\R0603_NIC_NRC.pdf; Author: CERN DEM JLC; CreateDate: 03.12.2007; LatestRevisionDate: 13.03.2008
R5 R6 R12 = R0603_1R_1%_0.1W_200PPM: Resistor - 1%; Part Description: General Purpose Thick Film Chip Resistor; Manufacturer: GENERIC; Manufacturer1 Part Number: 232270461008L or RC0603FR-071RL; Power: 0.1W; TC: ±200ppm/°C; Part Number: R0603_1R_1%_0.1W_200PPM; Component Kind: Standard; Component Type: Standard; Pin Count: 2; Value: 1; Status: Preferred; Tolerance: ±1%; Manufacturer Part Number: R0603_1R_1%_0.1W_200PPM; Case: 0603; Mounted: Yes; Sense: No; Socket: No; SMD: Yes; Manufacturer1 Example: YAGEO PHYCOMP; Manufacturer1 ComponentHeight: 0.65mm; HelpURL: \\cern.ch\dfs\Applications\Altium\Datasheets\R0603_Phycomp_RC0603.pdf; Author: CERN DEM JLC; CreateDate: 2007-12-03; LatestRevisionDate: 2012-10-17
R7 = R0603_30K_1%_0.1W_100PPM: Resistor - 1%; Part Description: General Purpose Thick Film Chip Resistor; Manufacturer: GENERIC; Manufacturer1 Part Number: NRC06F3002TRF; Power: 0.1W; TC: ±100ppm/°C; PressFit: No; Part Number: R0603_30K_1%_0.1W_100PPM; Component Kind: Standard; Component Type: Standard; Pin Count: 2; Value: 30k; Status: Preferred; Tolerance: ±1%; Manufacturer Part Number: R0603_30K_1%_0.1W_100PPM; Case: 0603; Mounted: Yes; Sense: No; Socket: No; SMD: Yes; Manufacturer1 Example: NIC COMPONENT; Manufacturer1 ComponentHeight: 0.55mm; HelpURL: \\cern.ch\dfs\Applications\Altium\Datasheets\R0603_NIC_NRC.pdf; Author: CERN DEM JLC; CreateDate: 03.12.2007; LatestRevisionDate: 13.03.2008
R9 R10 R19 R120 = R0603_3K_1%_0.1W_100PPM: Resistor - 1%; Part Description: General Purpose Thick Film Chip Resistor; Manufacturer: GENERIC; Manufacturer1 Part Number: NRC06F3001TRF; Power: 0.1W; TC: ±100ppm/°C; Part Number: R0603_3K_1%_0.1W_100PPM; Component Kind: Standard; Component Type: Standard; Pin Count: 2; Value: 3k; Status: Preferred; Tolerance: ±1%; Manufacturer Part Number: R0603_3K_1%_0.1W_100PPM; Case: 0603; Mounted: Yes; Sense: No; Socket: No; SMD: Yes; Manufacturer1 Example: NIC COMPONENT; Manufacturer1 ComponentHeight: 0.55mm; HelpURL: \\cern.ch\dfs\Applications\Altium\Datasheets\R0603_NIC_NRC.pdf; Author: CERN DEM JLC; CreateDate: 2007-12-03; LatestRevisionDate: 2008-03-13
R11 R14 = R0603_47K_1%_0.1W_100PPM: Resistor - 1%; Part Description: General Purpose Thick Film Chip Resistor; Manufacturer: GENERIC; Manufacturer1 Part Number: NRC06F4702TRF; Power: 0.1W; TC: ±100ppm/°C; PressFit: No; Part Number: R0603_47K_1%_0.1W_100PPM; Component Kind: Standard; Component Type: Standard; Pin Count: 2; Value: 47k; Status: Preferred; Tolerance: ±1%; Manufacturer Part Number: R0603_47K_1%_0.1W_100PPM; Case: 0603; Mounted: Yes; Sense: No; Socket: No; SMD: Yes; Manufacturer1 Example: NIC COMPONENT; Manufacturer1 ComponentHeight: 0.55mm; HelpURL: \\cern.ch\dfs\Applications\Altium\Datasheets\R0603_NIC_NRC.pdf; Author: CERN DEM JLC; CreateDate: 03.12.2007; LatestRevisionDate: 13.03.2008
R13 = R0603_4K7_1%_0.1W_100PPM: as R15 on sheet mainboard; Part Number: R0603_4K7_1%_0.1W_100PPM; Component Kind: Standard; Component Type: Standard; Pin Count: 2; Value: 4k7; Status: Preferred; Tolerance: ±1%; Manufacturer Part Number: R0603_4K7_1%_0.1W_100PPM; Case: 0603; Mounted: Yes; Sense: No; Socket: No; SMD: Yes; Manufacturer1 Example: NIC COMPONENT; Manufacturer1 ComponentHeight: 0.55mm; HelpURL: \\cern.ch\dfs\Applications\Altium\Datasheets\R0603_NIC_NRC.pdf; Author: CERN DEM JLC; CreateDate: 03.12.2007; LatestRevisionDate: 13.03.2008
RV18 = VAR_EPCOS_B72210S0461K101: Varistor; Part Description: SIOV Metal Oxide Varistor; Manufacturer: EPCOS; Manufacturer Part Number: B72210S0461K101 or  S10K460; Power: 0.4W; Tolerance: ±10%; Part Number: VAR_EPCOS_B72210S0461K101; Component Kind: Standard; Component Type: Standard; Pin Count: 2; Status: None; Voltage: 460VAC; Mounted: Yes; Socket: No; SMD: No; Sense: No; ComponentHeight: 15mm; HelpURL: \\cern.ch\dfs\Applications\Altium\Datasheets\VAR_EPCOS_B72210S0461K101.pdf; Author: CERN DEM JLC; CreateDate: 2008-10-14; LatestRevisionDate: 2011-09-15
T1 = BC847B: NPN Transistor; Part Description: 45V 100mA NPN General-Purpose Transistor; Manufacturer: NXP SEMICONDUCTORS; PressFit: No; Bonding: No; Part Number: BC847B; Component Kind: Standard; Component Type: Standard; Device: BC847B; PackageDescription: SOT23, 0.95mm Pitch; 3 Pin, 1.30mm W X 2.90mm L X 1.10mm H body, IPC Medium Density; Manufacturer Part Number: BC847B; Pin Count: 3; Case: SOT23-3; Mounted: Yes; Socket: No; SMD: Yes; Sense: No; ComponentHeight: 1.1mm; HelpURL: \\cern.ch\dfs\Applications\Altium\Datasheets\BC847B.pdf; Author: CERN DEM JLC; CreateDate: 14.06.2011; LatestRevisionDate: 14.06.2011

## Sheet CAN_IFC.SchDoc
size A4
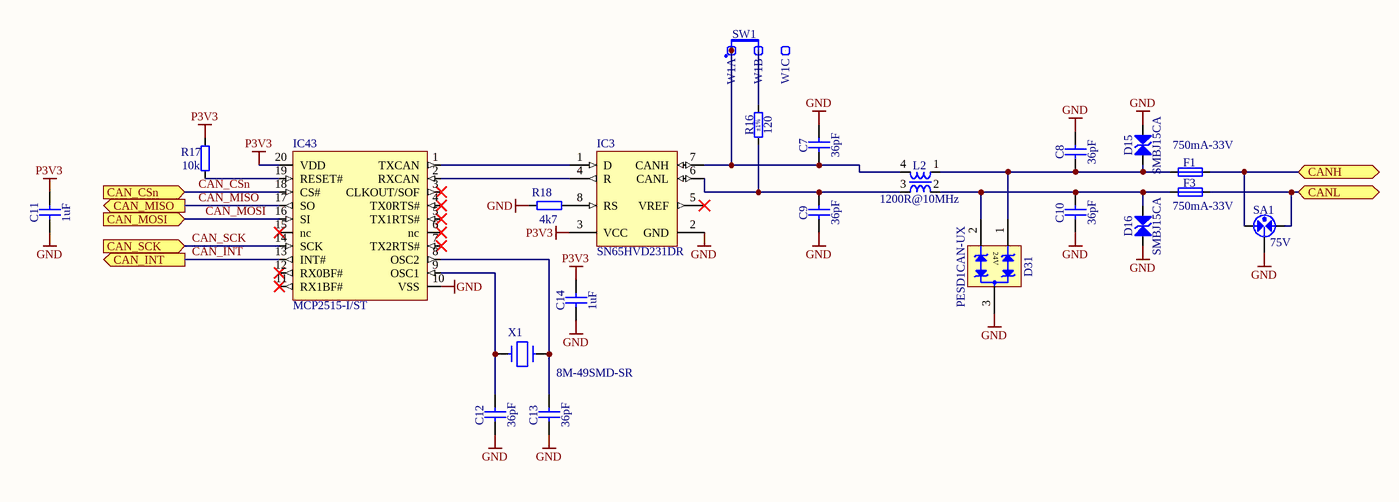
[diagram p3: CAN_IFC.SchDoc]

### Parts
C7  36pF  [CAPC1608X87N]
C8  36pF  [CAPC1608X87N]
C9  36pF  [CAPC1608X87N]
C10  36pF  [CAPC1608X87N]
C11  1uF  [CAPC1608X87N]
C12  36pF  [CAPC1608X87N]
C13  36pF  [CAPC1608X87N]
C14  1uF  [CAPC1608X87N]
D15  SMBJ15CA  [DIOM5336X265N]
D16  SMBJ15CA  [DIOM5336X265N]
D31  PESD1CAN-UX  [SOT95P237X112-3N]
F1  750mA-33V  [FUSRC4632X150N]
F3  750mA-33V  [FUSRC4632X150N]
IC3  SN65HVD231DR  [D0008A_L]
IC43  MCP2515-I/ST  [SOP65P640X110-20N]
L2  1200R@10MHz  [IND_TDK_ACT45B]
R16  120  Tolerance: ±1%  [RESC3216X65N]
R17  10k  [RESC1608X55N]
R18  4k7  [RESC1608X55N]
SA1  75V  [SAR_BOURNS_2036-xx-SM]
SW1  Jumper Type1  [JUMPER_BLACK_INSULATED_2.54MM]  (value not drawn)
W1  Test Point  [COMATEL_385.0358.1.03.400]  (value not drawn)  (parts A,B,C of 3)
X1  8M-49SMD-SR  [HC-49SM]

### Ports
CAN_CSn (in), CAN_INT (out), CAN_MISO (out), CAN_MOSI (in), CAN_SCK (in), CANH (bidir), CANL (bidir)

### Nets
GND: C7.2 C8.2 C9.1 C10.1 C11.1 C12.1 C13.1 C14.1 D15.2 D16.1 D31.3(GND) IC3.2(GND) IC43.10(VSS) R18.2 SA1.3
P3V3: C11.2 C14.2 IC3.3(VCC) IC43.20(VDD) R17.2
CAN_CSn: IC43.18(CS#) ; port CAN_CSn
CAN_INT: IC43.13(INT#) ; port CAN_INT
CAN_MISO: IC43.17(SO) ; port CAN_MISO
CAN_MOSI: IC43.16(SI) ; port CAN_MOSI
CAN_SCK: IC43.14(SCK) ; port CAN_SCK
eCAN_H: F1.2 SA1.1 ; port CANH
eCAN_L: F3.2 SA1.2 ; port CANL
NetC7_1: C7.1 IC3.7(CANH) L2.4 SW1.1 W1.1
NetC8_1: C8.1 D15.1 D31.1(I/O1) F1.1 L2.1
NetC9_2: C9.2 IC3.6(CANL) L2.3 R16.1
NetC10_2: C10.2 D16.2 D31.2(I/O2) F3.1 L2.2
NetC12_2: C12.2 IC43.9(OSC1) X1.1
NetC13_2: C13.2 IC43.8(OSC2) X1.2
NetIC3_1: IC3.1(D) IC43.1(TXCAN)
NetIC3_4: IC3.4(R) IC43.2(RXCAN)
NetIC3_8: IC3.8(RS) R18.1
NetIC43_19: IC43.19(RESET#) R17.1
NetR16_2: R16.2 W1.2

Not connected (* = marked no-connect by the designer): IC3 5(VREF)*; IC43 3(CLKOUT/SOF)* 4(TX0RTS#)* 5(TX1RTS#)* 6(nc)* 7(TX2RTS#)* 11(RX1BF#)* 12(RX0BF#)* 15(nc)*; W1 3

### Library data of the parts
C7-C10 C12 C13 = CC0603_36PF_50V_5%_C0G: Non-polarised capacitor; Part Description: SMD Multilayer Chip Ceramic Capacitor; Manufacturer: GENERIC; Manufacturer1 Part Number: CBR06C360J5GACAUTO; Voltage: 50V; TC: C0G/NP0; Tolerance: ±5%; Part Number: CC0603_36PF_50V_5%_C0G; Component Kind: Standard; Component Type: Standard; Pin Count: 2; Value: 36pF; Status: Preferred; Manufacturer Part Number: CC0603_36PF_50V_5%_C0G; Case: 0603; Mounted: Yes; Socket: No; SMD: Yes; Sense: No; Manufacturer1 Example: KEMET; Manufacturer1 ComponentHeight: 0.87mm; HelpURL: \\cern.ch\dfs\Applications\Altium\Datasheets\CC0603_C0G_KEMET_HiQ-CBR(Automotive).pdf; Author: CERN DEM HF; CreateDate: 03.11.2022; LatestRevisionDate: 03.11.2022
C11 C14 = CC0603_1UF_25V_10%_X7R: as C5 on sheet supply; Part Number: CC0603_1UF_25V_10%_X7R; Component Kind: Standard; Component Type: Standard; Pin Count: 2; Value: 1uF; Status: None; Manufacturer Part Number: CC0603_1UF_25V_10%_X7R; Case: 0603; Mounted: Yes; Socket: No; SMD: Yes; Sense: No; Manufacturer1 Example: MURATA; Manufacturer1 ComponentHeight: 0.9mm; HelpURL: \\cern.ch\dfs\Applications\Altium\Datasheets\CC0603_X7R_MURATA.pdf; Author: CERN DEM JLC; CreateDate: 2011-01-18; LatestRevisionDate: 2011-01-18
D15 D16 = SMBJ15CA: Transient Voltage Suppressor Diode (Bi-Directional); Part Description: Bi-Directional Transient Voltage Suppressor Diode; Manufacturer: FAIRCHILD SEMICONDUCTOR; Voltage: 15V; Power: 600W; PressFit: No; Bonding: No; Part Number: SMBJ15CA; Component Kind: Standard; Component Type: Standard; Device: SMBJ15CA; PackageDescription: DO-214-AA/SMB Diode, Molded Body; 5.34mm L X 3.625mm W X 2.65mm H, IPC Medium Density; Manufacturer Part Number: SMBJ15CA; Pin Count: 2; Case: DO-214AA; Mounted: Yes; Socket: No; SMD: Yes; Sense: No; ComponentHeight: 2.65mm; HelpURL: \\cern.ch\dfs\Applications\Altium\Datasheets\SMBJ.pdf; Author: CERN DEM JLC; CreateDate: 06.05.2008; LatestRevisionDate: 19.12.2011
D31 = D_TVS_PESD1CAN: TVS Diode for CAN; Manufacturer: Nexperia; Voltage: 24V; Power: 400W; PressFit: No; Bonding: No; Part Number: PESD1CAN-UX; Component Kind: Standard; Component Type: Standard; Device: PESD1CAN-UX; PackageDescription: SOT, 0.95mm, pitch; 3 pin,1.30mm W X 2.92mm L X 1.12mm H body, IPC Medium Density; Part Description: TVS Diode for CAN; Manufacturer Part Number: PESD1CAN-UX; Pin Count: 3; Case: SOT-23; Mounted: Yes; Socket: No; SMD: Yes; Sense: No; ComponentHeight: 1.12mm; HelpURL: \\cern.ch\dfs\Applications\Altium\Datasheets\SM712.TCT.pdf; Author: CERN DEM JLC; CreateDate: 03.09.2014; LatestRevisionDate: 13.01.2015
F1 F3 = FUSR1812_LITTELFUSE_miniSMDC075F/33: Fuse; Part Description: PolySwitch® PTC Overcurrent Protection Device; PressFit: No; Part Number: FUSR1812_LITTELFUSE_miniSMDC075F/33; Component Kind: Standard; Component Type: Standard; Pin Count: 2; PackageDescription: Chip Resettable Fuse, 2-Leads, Body 4.6x3.2mm, IPC Medium Density; Family: Fuses Resettable; Mounted: Yes; Socket: No; SMD: Yes; Sense: No; Value: 750mA-33V; Manufacturer: LITTELFUSE; Manufacturer Part Number: miniSMDC075F/33; ComponentHeight: 1.46mm; HelpURL: \\cern.ch\dfs\Applications\Altium\Datasheets\FUSR_LITTELFUSE_MINISMD.pdf; Author: CERN DEM HF; CreateDate: 22.02.2023; LatestRevisionDate: 22.02.2023
IC3 = CMP-0315-00078-2: 3.3V CAN Transceiver with Sleep Mode, 17 mA, 3.3 V, -40 to 85 degC, 8-pin SOIC (D), Green (RoHS & no Sb/Br); Manufacturer: Texas Instruments; Drivers Per Package: 1; Transient Pulse Protection(V): -25 to 25; Supply Voltage(s)(V): 3.3; ICC(Max)(mA): 17; Rating: Catalog; PackageVersion: revM, Jun-2011; Footprint: PCA82C250; Isolated: No; PartNumber: SN65HVD231DR; Low Power Mode: Sleep; ComponentLink1Description: Datasheet; DatasheetVersion: SLOS346K; PackageReference: D0008A; SubFamily: CAN; Eco-Plan: Green (RoHS & no Sb/Br); Features: Bus Wake Up; Code_JEDEC: MS-012AA; Receivers Per Package: 1; PackageDescription: 8-Pin Plastic Small Outline Integrated Circuit, 4.9 x 3.9 mm, Pitch 1.27 mm Pitch; Mounting Technology: Surface Mount; ComponentLink1URL: http://www.ti.com/general/docs/lit/getliterature.tsp?genericPartNumber=SN65HVD231&fileType=pdf
IC43 = IFC_MCP2515_TSSOP: CAN Controller With SPI nterface; Manufacturer: Microchip; Manufacturer Part Number: MCP2515T-I/ST; Part Description: Stand-Alone CAN Controller with SPI Interface; Case: TSSOP20; Component Type: Standard; Device: MCP2515; Mounted: Yes; PackageDescription: TSSOP 20, Pitch 0.65mm - Body 4.5x6.5mm, IPC Medium Density; Part Number: MCP2515T-I/ST; Pin Count: 20; SMD: Yes
L2 = IND_TDK_ACT45B-220-2P: Inductor Common Mode; Part Description: Common Mode Filters For Automotive Signal Line, TDK ACT Series; Manufacturer: TDK; Manufacturer Part Number: ACM45B-220-2P; Power: 200mA; Resistance: 1R; Part Number: IND_TDK_ACT45B-220-2P; Component Kind: Standard; Component Type: Standard; Pin Count: 2; Value: 1200R@10MHz; Mounted: Yes; Socket: No; SMD: Yes; Sense: No; ComponentHeight: 3mm; HelpURL: \\cern.ch\dfs\Applications\Altium\Datasheets\IND_TDK_ACT45B.pdf; Author: CERN DEM BC; CreateDate: 09.04.2020; LatestRevisionDate: 09.04.2020
R16 = R1206_120R_1%_0.25W_100PPM: Resistor - 1%; Part Description: General Purpose Thick Film Chip Resistor; Manufacturer: GENERIC; Manufacturer1 Part Number: NRC12F1200TRF; Power: 0.25W; TC: ±100ppm/°C; PressFit: No; Part Number: R1206_120R_1%_0.25W_100PPM; Component Kind: Standard; Component Type: Standard; Pin Count: 2; Value: 120; Status: Preferred; Manufacturer Part Number: R1206_120R_1%_0.25W_100PPM; Case: 1206; Mounted: Yes; Sense: No; Socket: No; SMD: Yes; Manufacturer1 Example: NIC COMPONENT; Manufacturer1 ComponentHeight: 0.65mm; HelpURL: \\cern.ch\dfs\Applications\Altium\Datasheets\R1206_NIC_NRC.pdf; Author: CERN DEM JLC; CreateDate: 03.12.2007; LatestRevisionDate: 13.03.2008
R17 = R0603_10K_1%_0.1W_100PPM: as R4 on sheet supply; Part Number: R0603_10K_1%_0.1W_100PPM; Component Kind: Standard; Component Type: Standard; Pin Count: 2; Value: 10k; Status: Preferred; Tolerance: ±1%; Manufacturer Part Number: R0603_10K_1%_0.1W_100PPM; Case: 0603; Mounted: Yes; Sense: No; Socket: No; SMD: Yes; Manufacturer1 Example: NIC COMPONENT; Manufacturer1 ComponentHeight: 0.55mm; HelpURL: \\cern.ch\dfs\Applications\Altium\Datasheets\R0603_NIC_NRC.pdf; Author: CERN DEM JLC; CreateDate: 03.12.2007; LatestRevisionDate: 13.03.2008
R18 = R0603_4K7_1%_0.1W_100PPM: as R15 on sheet mainboard; Part Number: R0603_4K7_1%_0.1W_100PPM; Component Kind: Standard; Component Type: Standard; Pin Count: 2; Value: 4k7; Status: Preferred; Tolerance: ±1%; Manufacturer Part Number: R0603_4K7_1%_0.1W_100PPM; Case: 0603; Mounted: Yes; Sense: No; Socket: No; SMD: Yes; Manufacturer1 Example: NIC COMPONENT; Manufacturer1 ComponentHeight: 0.55mm; HelpURL: \\cern.ch\dfs\Applications\Altium\Datasheets\R0603_NIC_NRC.pdf; Author: CERN DEM JLC; CreateDate: 03.12.2007; LatestRevisionDate: 13.03.2008
SA1 = SAR_BOURNS_2036-07-SMLF: Surge Arrester; Part Description: 3-electrode Precision Gas Discharge Tube Surge Protector 2036-xx-SM Series; Manufacturer: BOURNS; PressFit: No; Part Number: SAR_BOURNS_2036-07-SMLF; Component Kind: Standard; Component Type: Standard; Pin Count: 3; PackageDescription: 3-electrode Precision Gas Discharge Tube Surge Protector Body D5 mm x L7.3 mm; Family: Surge Arrester; Mounted: Yes; Socket: No; SMD: Yes; Sense: No; Value: 75V; Manufacturer Part Number: 2036-07-SMLF; ComponentHeight: 5mm; HelpURL: \\cern.ch\dfs\Applications\Altium\Datasheets\SAR_BOURNS_2036-xx-SM.pdf; Author: CERN DEM JLC; CreateDate: 06.04.2011; LatestRevisionDate: 06.04.2011
SW1 = COMATEL_313.1730.0.00.40.0: as SW4 on sheet mainboard; Part Number: COMATEL_313.1730.0.00.40.0; Component Kind: Accessories; Component Type: Standard; Pin Count: 1; Family: Jumper; Mounted: Yes; Socket: No; SMD: No; Sense: No; Status: Obsolete; Manufacturer Part Number: 313.1730.0.00.40.0; ComponentHeight: 6.5mm; HelpURL: \\cern.ch\dfs\Applications\Altium\Datasheets\COMATEL_313.1730.0.00.40.0.pdf; Author: CERN DEM JLC; CreateDate: 09.04.2008; LatestRevisionDate: 27.08.2013
W1 = COMATEL_385.0358.1.03.400: as W4 on sheet mainboard; Part Number: COMATEL_385.0358.1.03.400; Component Kind: Standard; Component Type: Standard; Pin Count: 3; Family: Test Point; Mounted: Yes; Socket: No; SMD: No; Sense: No; Status: Not recommended; Manufacturer Part Number: 385.0358.1.03.400; ComponentHeight: 8mm; HelpURL: \\cern.ch\dfs\Applications\Altium\Datasheets\COMATEL_385.0358.1.03.400.pdf; Author: CERN DEM JLC; CreateDate: 30.06.2010; LatestRevisionDate: 10.10.2012
X1 = X_CRYSTAL_HC49_SMT: 8MHz; ±30ppm; 20pF; SMD; HC49SMD; Supplier 1: Newark; Supplier Part Number 1: 56P2843

## Nets that join several sheets
GND: mainboard (B8.1 J9.2 J9.12), POWER_SWITCHES (23 pins), supply (28 pins), CAN_IFC (15 pins)
P3V3: mainboard (J9.9 J9.11), supply (R19.1), CAN_IFC (5 pins)
P5V0: mainboard (B7.1 R15.2), supply (C69.1 C72.2 L5.2 R120.1)
P12V0: POWER_SWITCHES (5 pins), supply (D17.1 D18.1)
CAN_CSn: mainboard (J9.10 W4.1), CAN_IFC (IC43.18)
CAN_INT: mainboard (J9.7), CAN_IFC (IC43.13)
CAN_MISO: mainboard (J9.8), CAN_IFC (IC43.17)
CAN_MOSI: mainboard (J9.6), CAN_IFC (IC43.16)
CAN_SCK: mainboard (J9.5), CAN_IFC (IC43.14)
eCAN_H: POWER_SWITCHES (W3.3), CAN_IFC (F1.2 SA1.1)
eCAN_L: POWER_SWITCHES (W2.3), CAN_IFC (F3.2 SA1.2)
Sig_REL_IGN: mainboard (SW4.1 W4.2), POWER_SWITCHES (IC11.4)
Sig_REL_N: mainboard (J9.3), POWER_SWITCHES (IC11.2)
Sig_REL_P: mainboard (J9.4), POWER_SWITCHES (IC11.3)
Sig_REL_PCH: mainboard (J9.1), POWER_SWITCHES (IC11.1)

## Assembly variants
Standard: not fitted C31 C43 C54 C59 IC6 IC21 J2 JP1 PB1 PB2 R49 R51 R52 R53 R54 R55 R57 R63 R64 R65 R66 R67 R68 RV14 RV17 SH1 SH2 T6